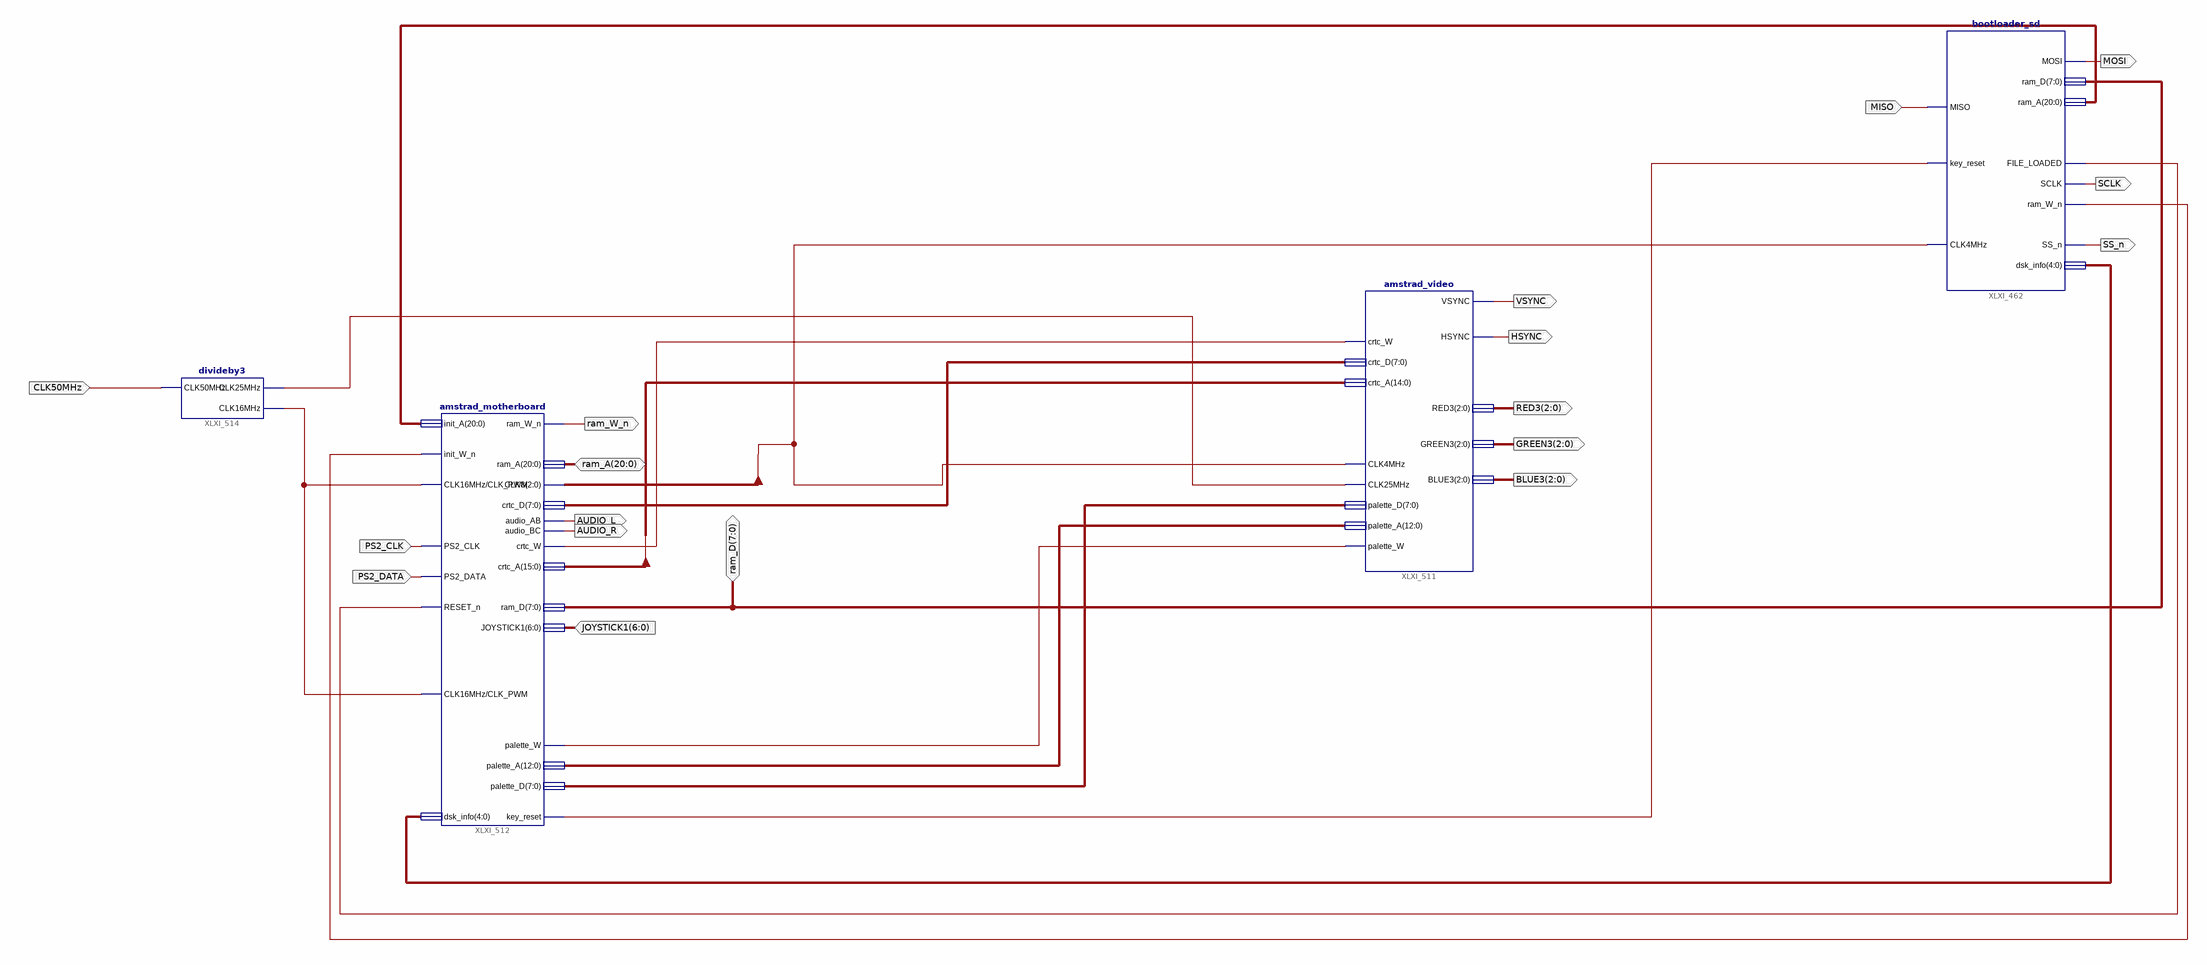
[diagram p0: schematic sheet 1]
// Xilinx ISE schematic amstrad_switch_z80_vga_sd.sch (spartan6) as structural Verilog: 4 symbols, 18 ports
module amstrad_switch_z80_vga_sd (
  input  CLK50MHz,
  input  MISO,
  input  PS2_DATA,
  input  PS2_CLK,
  input  [6:0] JOYSTICK1,
  inout  [7:0] ram_D,
  inout  [20:0] ram_A,
  output MOSI,
  output SCLK,
  output SS_n,
  output [2:0] BLUE3,
  output [2:0] GREEN3,
  output [2:0] RED3,
  output VSYNC,
  output HSYNC,
  output ram_W_n,
  output AUDIO_L,
  output AUDIO_R
);

  wire RESET_n, XLXN_646, XLXN_717, XLXN_731, XLXN_736, XLXN_744, XLXN_750;
  wire [2:0] CLK8;
  wire [4:0] XLXN_751;
  wire [7:0] XLXN_732, XLXN_746;
  wire [12:0] XLXN_745;
  wire [15:0] crtc_A;
  wire [20:0] XLXN_737;

  bootloader_sd XLXI_462 (
    .MISO(MISO), .CLK4MHz(CLK8[2]), .key_reset(XLXN_750), .ram_D(ram_D), .MOSI(MOSI), .ram_A(XLXN_737),
    .SCLK(SCLK), .ram_W_n(XLXN_736), .SS_n(SS_n), .FILE_LOADED(RESET_n), .dsk_info(XLXN_751));
  amstrad_video XLXI_511 (
    .crtc_W(XLXN_731), .crtc_D(XLXN_732), .crtc_A(crtc_A[14:0]), .CLK4MHz(CLK8[2]), .CLK25MHz(XLXN_646),
    .palette_D(XLXN_746), .palette_A(XLXN_745), .palette_W(XLXN_744), .HSYNC(HSYNC), .VSYNC(VSYNC),
    .RED3(RED3), .GREEN3(GREEN3), .BLUE3(BLUE3));
  amstrad_motherboard XLXI_512 (
    .init_A(XLXN_737), .init_W_n(XLXN_736), .CLK16MHz(XLXN_717), .PS2_CLK(PS2_CLK), .PS2_DATA(PS2_DATA),
    .RESET_n(RESET_n), .JOYSTICK1(JOYSTICK1), .CLK_PWM(XLXN_717), .dsk_info(XLXN_751), .ram_D(ram_D),
    .CLK8(CLK8), .ram_A(ram_A), .audio_BC(AUDIO_R), .crtc_A(crtc_A), .crtc_W(XLXN_731), .ram_W_n(ram_W_n),
    .crtc_D(XLXN_732), .palette_W(XLXN_744), .palette_A(XLXN_745), .palette_D(XLXN_746),
    .key_reset(XLXN_750), .audio_AB(AUDIO_L));
  divideby3 XLXI_514 (.CLK50MHz(CLK50MHz), .CLK25MHz(XLXN_646), .CLK16MHz(XLXN_717));
endmodule
